# EAGLE design vivepos-v1-1 (EAGLE 6.4)
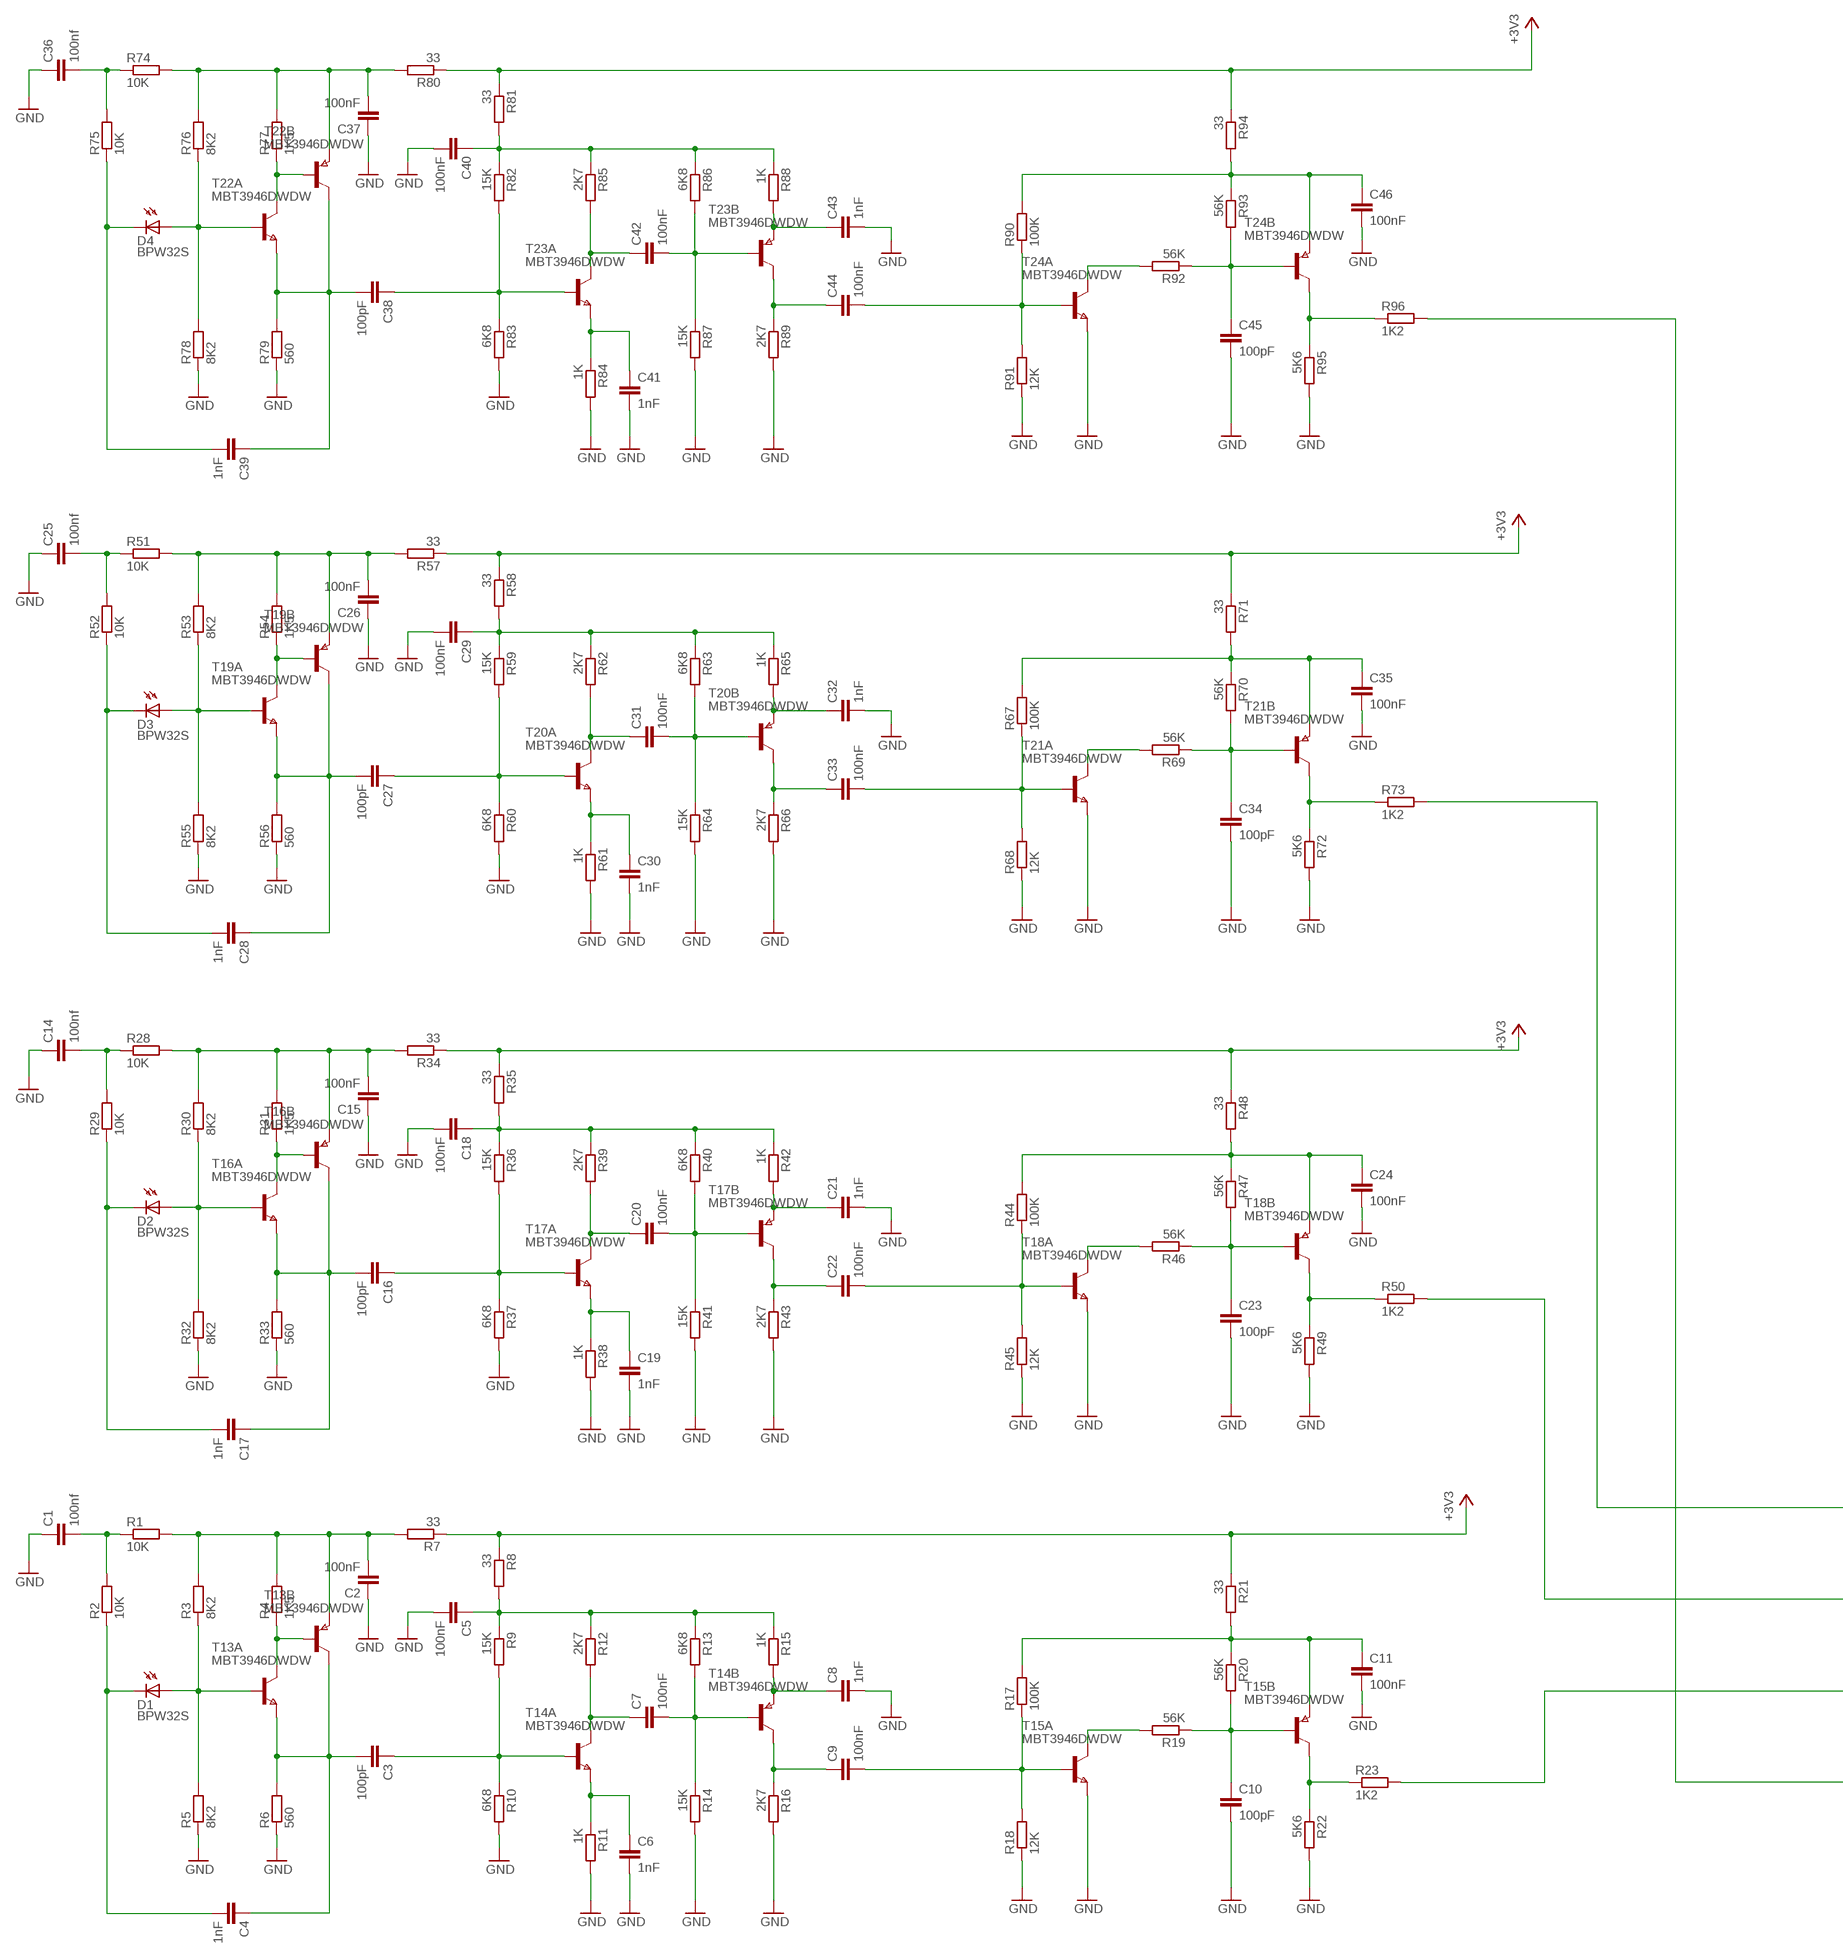
[diagram p0: schematic, sheet 1, part 1 of 2]
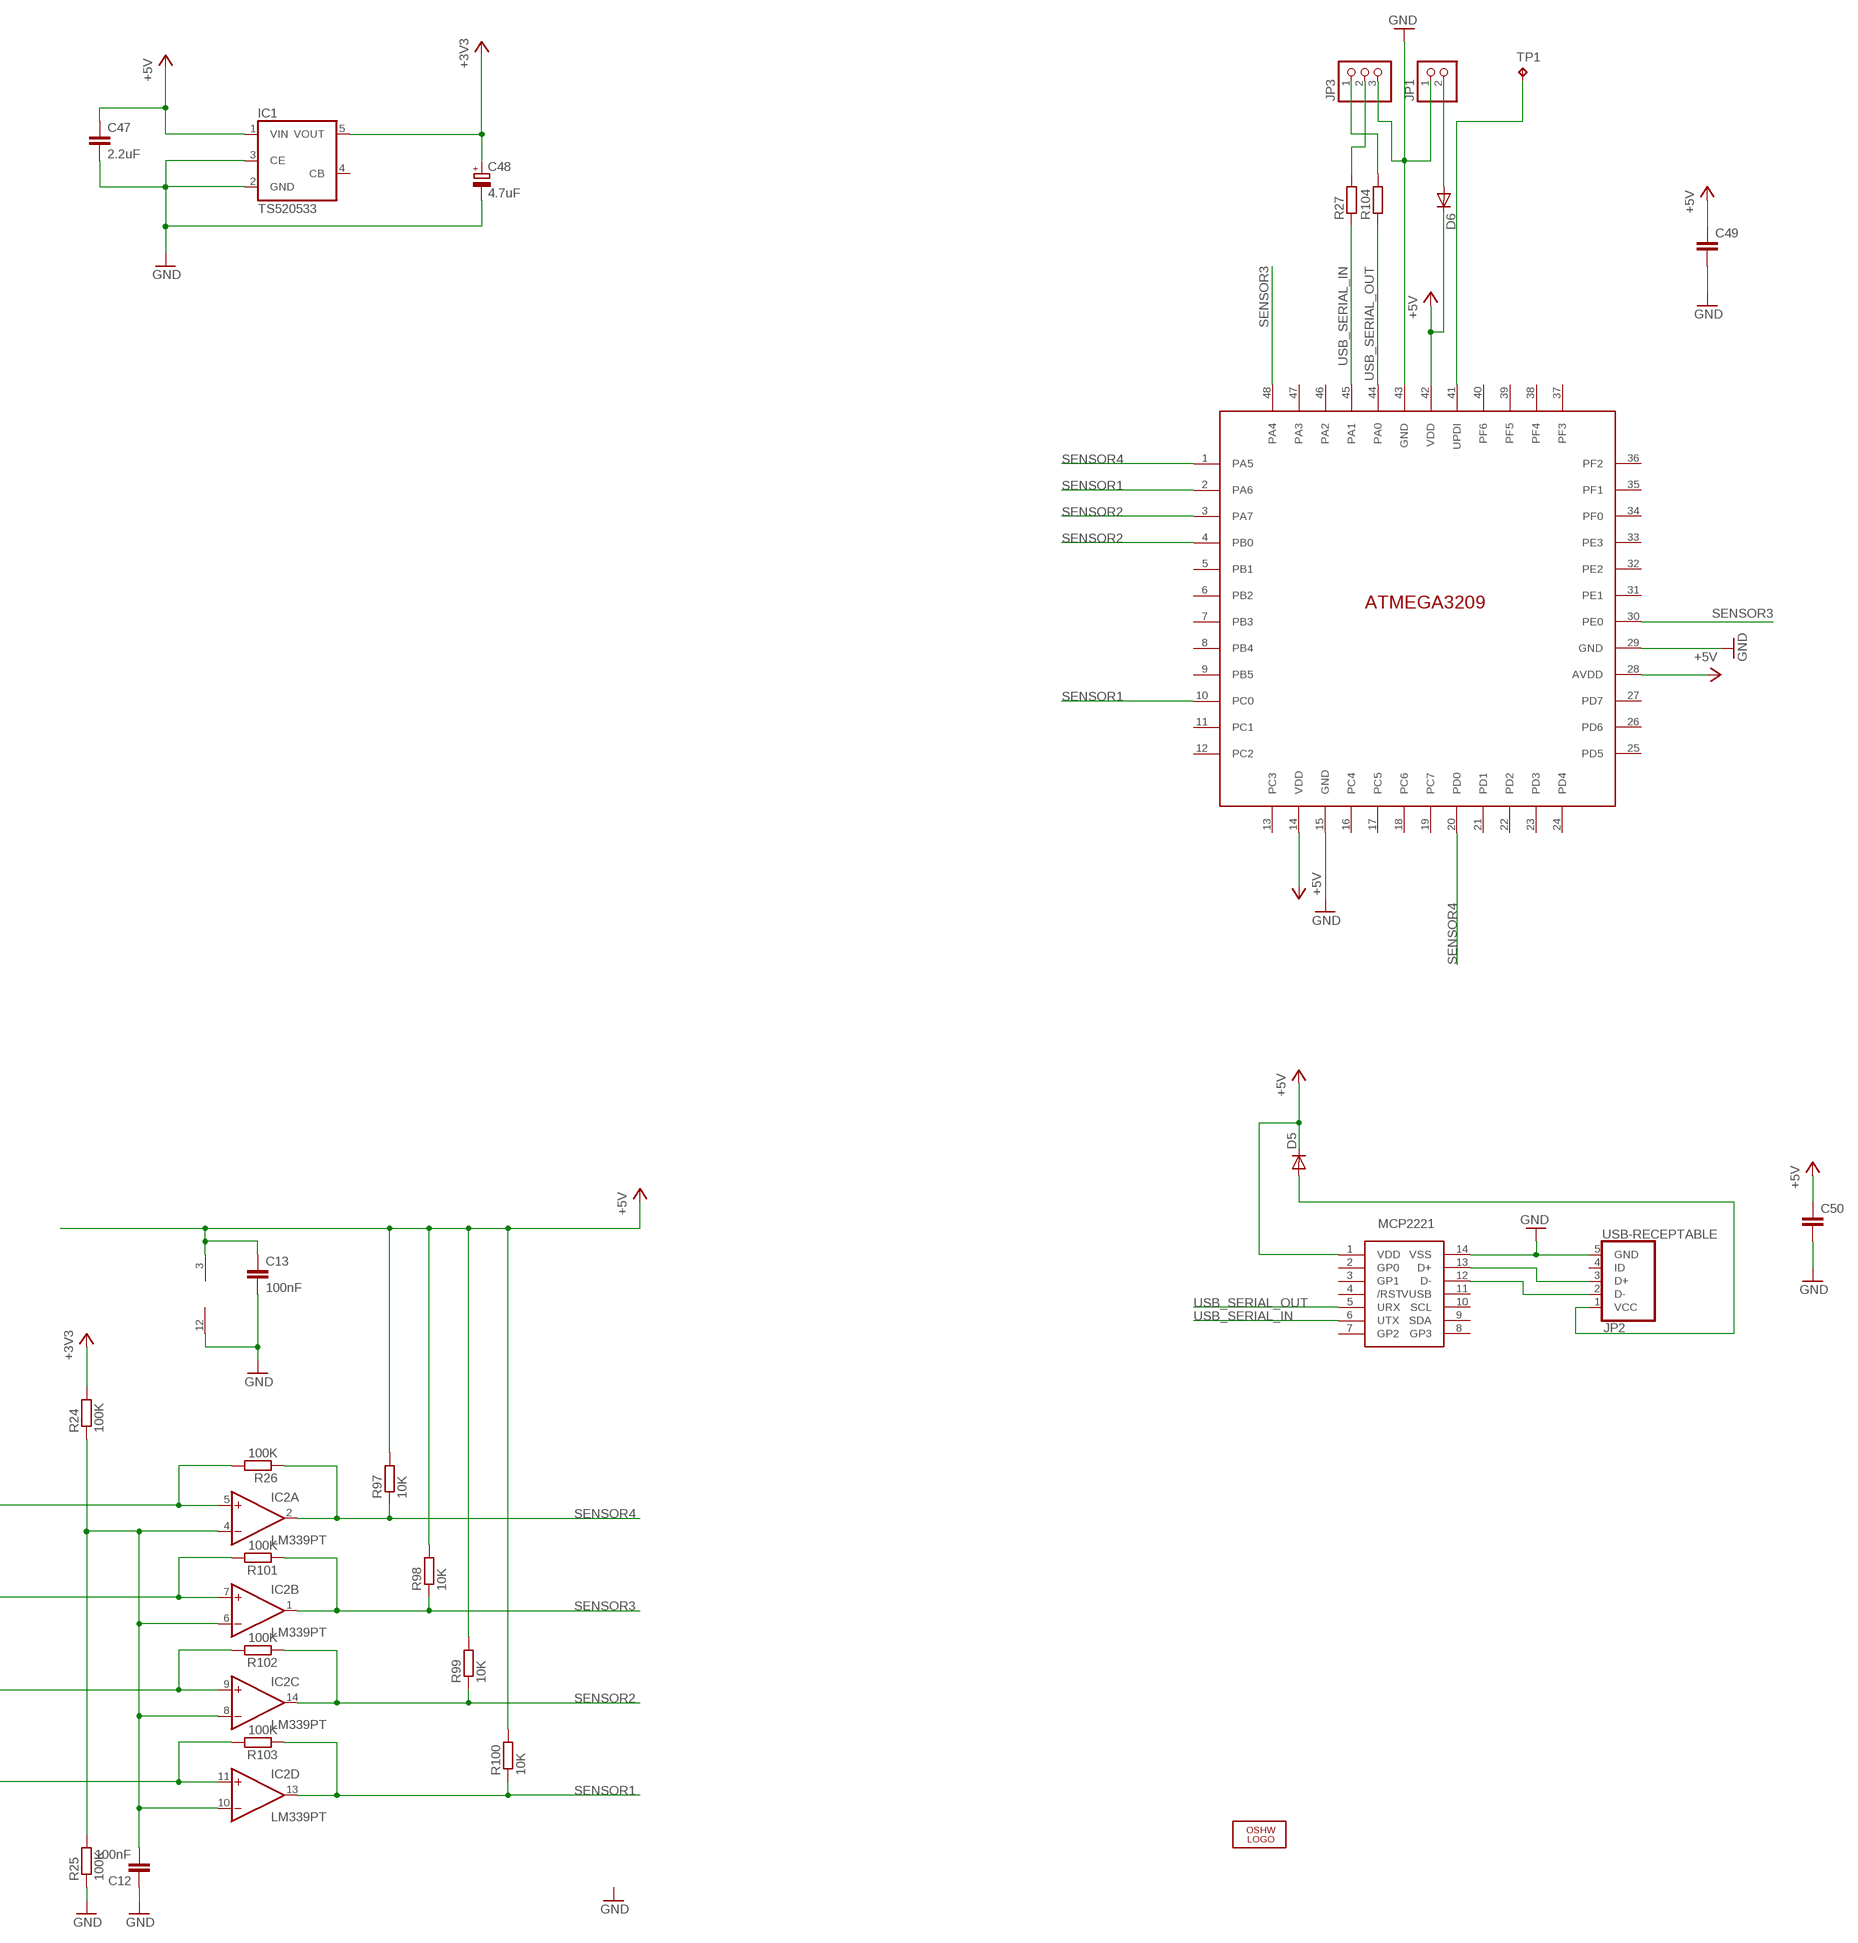
[diagram p1: schematic, sheet 1, part 2 of 2]

## Parts
C1  100nf  C-EUC0402  [C0402]
C2  100nF  C-EUC0402  [C0402]
C3  100pF  C-EUC0402  [C0402]
C4  1nF  C-EUC0402  [C0402]
C5  100nF  C-EUC0402  [C0402]
C6  1nF  C-EUC0402  [C0402]
C7  100nF  C-EUC0402  [C0402]
C8  1nF  C-EUC0402  [C0402]
C9  100nF  C-EUC0402  [C0402]
C10  100pF  C-EUC0402  [C0402]
C11  100nF  C-EUC0402  [C0402]
C12  100nF  C-EUC0402  [C0402]
C13  100nF  C-EUC0402  [C0402]
C14  100nf  C-EUC0402  [C0402]
C15  100nF  C-EUC0402  [C0402]
C16  100pF  C-EUC0402  [C0402]
C17  1nF  C-EUC0402  [C0402]
C18  100nF  C-EUC0402  [C0402]
C19  1nF  C-EUC0402  [C0402]
C20  100nF  C-EUC0402  [C0402]
C21  1nF  C-EUC0402  [C0402]
C22  100nF  C-EUC0402  [C0402]
C23  100pF  C-EUC0402  [C0402]
C24  100nF  C-EUC0402  [C0402]
C25  100nf  C-EUC0402  [C0402]
C26  100nF  C-EUC0402  [C0402]
C27  100pF  C-EUC0402  [C0402]
C28  1nF  C-EUC0402  [C0402]
C29  100nF  C-EUC0402  [C0402]
C30  1nF  C-EUC0402  [C0402]
C31  100nF  C-EUC0402  [C0402]
C32  1nF  C-EUC0402  [C0402]
C33  100nF  C-EUC0402  [C0402]
C34  100pF  C-EUC0402  [C0402]
C35  100nF  C-EUC0402  [C0402]
C36  100nf  C-EUC0402  [C0402]
C37  100nF  C-EUC0402  [C0402]
C38  100pF  C-EUC0402  [C0402]
C39  1nF  C-EUC0402  [C0402]
C40  100nF  C-EUC0402  [C0402]
C41  1nF  C-EUC0402  [C0402]
C42  100nF  C-EUC0402  [C0402]
C43  1nF  C-EUC0402  [C0402]
C44  100nF  C-EUC0402  [C0402]
C45  100pF  C-EUC0402  [C0402]
C46  100nF  C-EUC0402  [C0402]
C47  2.2uF  C-EUC0805  [C0805]
C48  4.7uF  CPOL-EUB/3528-21R  [B/3528-21R]
C49  C-EUC0402  [C0402]
C50  C-EUC0603  [C0603]
D1  BPW32S  [BPW34S]
D2  BPW32S  [BPW34S]
D3  BPW32S  [BPW34S]
D4  BPW32S  [BPW34S]
D5  DIODE-SOD323-W  [SOD323-W]
D6  DIODE-SOD323-W  [SOD323-W]
IC1  TS520533  [SOT25]
IC2  LM339PT  [TSSOP14]
JP1  PINHD-1X2  [1X02]
JP2  USB-RECEPTABLE  [FCI-10103594-0001LF]
JP3  PINHD-1X3  [1X03]
LOGO1  OSHW_LOGO_FILLX0200-NT  [OSHW_FILLX200_NOTEXT]
R1  10K  R-EU_R0402  [R0402]
R2  10K  R-EU_R0402  [R0402]
R3  8K2  R-EU_R0402  [R0402]
R4  1K5  R-EU_R0402  [R0402]
R5  8K2  R-EU_R0402  [R0402]
R6  560  R-EU_R0402  [R0402]
R7  33  R-EU_R0402  [R0402]
R8  33  R-EU_R0402  [R0402]
R9  15K  R-EU_R0402  [R0402]
R10  6K8  R-EU_R0402  [R0402]
R11  1K  R-EU_R0402  [R0402]
R12  2K7  R-EU_R0402  [R0402]
R13  6K8  R-EU_R0402  [R0402]
R14  15K  R-EU_R0402  [R0402]
R15  1K  R-EU_R0402  [R0402]
R16  2K7  R-EU_R0402  [R0402]
R17  100K  R-EU_R0402  [R0402]
R18  12K  R-EU_R0402  [R0402]
R19  56K  R-EU_R0402  [R0402]
R20  56K  R-EU_R0402  [R0402]
R21  33  R-EU_R0402  [R0402]
R22  5K6  R-EU_R0402  [R0402]
R23  1K2  R-EU_R0402  [R0402]
R24  100K  R-EU_R0402  [R0402]
R25  100K  R-EU_R0402  [R0402]
R26  100K  R-EU_R0402  [R0402]
R27  R-EU_R0402  [R0402]
R28  10K  R-EU_R0402  [R0402]
R29  10K  R-EU_R0402  [R0402]
R30  8K2  R-EU_R0402  [R0402]
R31  1K5  R-EU_R0402  [R0402]
R32  8K2  R-EU_R0402  [R0402]
R33  560  R-EU_R0402  [R0402]
R34  33  R-EU_R0402  [R0402]
R35  33  R-EU_R0402  [R0402]
R36  15K  R-EU_R0402  [R0402]
R37  6K8  R-EU_R0402  [R0402]
R38  1K  R-EU_R0402  [R0402]
R39  2K7  R-EU_R0402  [R0402]
R40  6K8  R-EU_R0402  [R0402]
R41  15K  R-EU_R0402  [R0402]
R42  1K  R-EU_R0402  [R0402]
R43  2K7  R-EU_R0402  [R0402]
R44  100K  R-EU_R0402  [R0402]
R45  12K  R-EU_R0402  [R0402]
R46  56K  R-EU_R0402  [R0402]
R47  56K  R-EU_R0402  [R0402]
R48  33  R-EU_R0402  [R0402]
R49  5K6  R-EU_R0402  [R0402]
R50  1K2  R-EU_R0402  [R0402]
R51  10K  R-EU_R0402  [R0402]
R52  10K  R-EU_R0402  [R0402]
R53  8K2  R-EU_R0402  [R0402]
R54  1K5  R-EU_R0402  [R0402]
R55  8K2  R-EU_R0402  [R0402]
R56  560  R-EU_R0402  [R0402]
R57  33  R-EU_R0402  [R0402]
R58  33  R-EU_R0402  [R0402]
R59  15K  R-EU_R0402  [R0402]
R60  6K8  R-EU_R0402  [R0402]
R61  1K  R-EU_R0402  [R0402]
R62  2K7  R-EU_R0402  [R0402]
R63  6K8  R-EU_R0402  [R0402]
R64  15K  R-EU_R0402  [R0402]
R65  1K  R-EU_R0402  [R0402]
R66  2K7  R-EU_R0402  [R0402]
R67  100K  R-EU_R0402  [R0402]
R68  12K  R-EU_R0402  [R0402]
R69  56K  R-EU_R0402  [R0402]
R70  56K  R-EU_R0402  [R0402]
R71  33  R-EU_R0402  [R0402]
R72  5K6  R-EU_R0402  [R0402]
R73  1K2  R-EU_R0402  [R0402]
R74  10K  R-EU_R0402  [R0402]
R75  10K  R-EU_R0402  [R0402]
R76  8K2  R-EU_R0402  [R0402]
R77  1K5  R-EU_R0402  [R0402]
R78  8K2  R-EU_R0402  [R0402]
R79  560  R-EU_R0402  [R0402]
R80  33  R-EU_R0402  [R0402]
R81  33  R-EU_R0402  [R0402]
R82  15K  R-EU_R0402  [R0402]
R83  6K8  R-EU_R0402  [R0402]
R84  1K  R-EU_R0402  [R0402]
R85  2K7  R-EU_R0402  [R0402]
R86  6K8  R-EU_R0402  [R0402]
R87  15K  R-EU_R0402  [R0402]
R88  1K  R-EU_R0402  [R0402]
R89  2K7  R-EU_R0402  [R0402]
R90  100K  R-EU_R0402  [R0402]
R91  12K  R-EU_R0402  [R0402]
R92  56K  R-EU_R0402  [R0402]
R93  56K  R-EU_R0402  [R0402]
R94  33  R-EU_R0402  [R0402]
R95  5K6  R-EU_R0402  [R0402]
R96  1K2  R-EU_R0402  [R0402]
R97  10K  R-EU_R0402  [R0402]
R98  10K  R-EU_R0402  [R0402]
R99  10K  R-EU_R0402  [R0402]
R100  10K  R-EU_R0402  [R0402]
R101  100K  R-EU_R0402  [R0402]
R102  100K  R-EU_R0402  [R0402]
R103  100K  R-EU_R0402  [R0402]
R104  R-EU_R0402  [R0402]
T13  MBT3946DWDW  [SOT363_PHILIPS]
T14  MBT3946DWDW  [SOT363_PHILIPS]
T15  MBT3946DWDW  [SOT363_PHILIPS]
T16  MBT3946DWDW  [SOT363_PHILIPS]
T17  MBT3946DWDW  [SOT363_PHILIPS]
T18  MBT3946DWDW  [SOT363_PHILIPS]
T19  MBT3946DWDW  [SOT363_PHILIPS]
T20  MBT3946DWDW  [SOT363_PHILIPS]
T21  MBT3946DWDW  [SOT363_PHILIPS]
T22  MBT3946DWDW  [SOT363_PHILIPS]
T23  MBT3946DWDW  [SOT363_PHILIPS]
T24  MBT3946DWDW  [SOT363_PHILIPS]
TP1  TPTP15R  [TP15R]
U$1  MCP2221  [SOIC14]
U$2  ATMEGA3209  [TQFP48]

## Nets
+3V3: C48.+ IC1.5(VOUT) R7.1 R8.1 R21.1 R24.2 R34.1 R35.1 R48.1 R57.1 R58.1 R71.1 R80.1 R81.1 R94.1
+5V: C13.1 C47.1 C49.1 C50.1 D5.C D6.C IC1.1(VIN) IC2.3(P:V+) R97.2 R98.2 R99.2 R100.2 U$1.1(VDD) U$2.14(VDD) U$2.28(AVDD) U$2.42(VDD)
GND: C1.1 C2.1 C5.2 C6.2 C8.2 C10.2 C11.2 C12.1 C13.2 C14.1 C15.1 C18.2 C19.2 C21.2 C23.2 C24.2 C25.1 C26.1 C29.2 C30.2 C32.2 C34.2 C35.2 C36.1 C37.1 C40.2 C41.2 C43.2 C45.2 C46.2 C47.2 C48.- C49.2 C50.2 IC1.2(GND) IC1.3(CE) IC2.12(P:GND) JP1.1 JP2.5(GND) JP3.3 R5.1 R6.1 R10.2 R11.2 R14.2 R16.2 R18.1 R22.2 R25.1 R32.1 R33.1 R37.2 R38.2 R41.2 R43.2 R45.1 R49.2 R55.1 R56.1 R60.2 R61.2 R64.2 R66.2 R68.1 R72.2 R78.1 R79.1 R83.2 R84.2 R87.2 R89.2 R91.1 R95.2 T15.1(A:E) T18.1(A:E) T21.1(A:E) T24.1(A:E) U$1.14(VSS) U$2.15(GND) U$2.29(GND) U$2.43(GND)
N$1: C1.2 R1.1 R2.2
N$2: C2.2 R1.2 R3.2 R4.2 R7.2 T13.4(B:E)
N$3: R4.1 T13.5(B:B) T13.6(A:C)
N$4: D1.A R3.1 R5.2 T13.2(A:B)
N$5: C3.2 C4.1 R6.2 T13.1(A:E) T13.3(B:C)
N$7: C5.1 R8.2 R9.1 R12.1 R13.1 R15.1
N$8: C3.1 R9.2 R10.1 T14.2(A:B)
N$9: C7.1 R12.2 T14.6(A:C)
N$10: C6.1 R11.1 T14.1(A:E)
N$11: C8.1 R15.2 T14.4(B:E)
N$12: C7.2 R13.2 R14.1 T14.5(B:B)
N$13: C9.1 R16.1 T14.3(B:C)
N$14: C4.2 D1.K(C) R2.1
N$15: C9.2 R17.1 R18.2 T15.2(A:B)
N$16: C11.1 R17.2 R20.1 R21.2 T15.4(B:E)
N$17: C10.1 R19.1 R20.2 T15.5(B:B)
N$18: R19.2 T15.6(A:C)
N$19: R22.1 R23.1 T15.3(B:C)
N$20: IC2.9(C:+IN) R23.2 R102.2
N$21: C12.2 IC2.4(A:-IN) IC2.6(B:-IN) IC2.8(C:-IN) IC2.10(D:-IN) R24.1 R25.2
N$22: C14.2 R28.1 R29.2
N$23: D6.A JP1.2
N$24: C15.2 R28.2 R30.2 R31.2 R34.2 T16.4(B:E)
N$25: R31.1 T16.5(B:B) T16.6(A:C)
N$26: D2.A R30.1 R32.2 T16.2(A:B)
N$27: C16.2 C17.1 R33.2 T16.1(A:E) T16.3(B:C)
N$28: D5.A JP2.1(VCC)
N$29: C18.1 R35.2 R36.1 R39.1 R40.1 R42.1
N$30: C16.1 R36.2 R37.1 T17.2(A:B)
N$31: C20.1 R39.2 T17.6(A:C)
N$32: C19.1 R38.1 T17.1(A:E)
N$33: C20.2 R40.2 R41.1 T17.5(B:B)
N$34: C21.1 R42.2 T17.4(B:E)
N$35: C22.1 R43.1 T17.3(B:C)
N$36: C17.2 D2.K(C) R29.1
N$37: C22.2 R44.1 R45.2 T18.2(A:B)
N$38: C24.1 R44.2 R47.1 R48.2 T18.4(B:E)
N$39: C23.1 R46.1 R47.2 T18.5(B:B)
N$40: R46.2 T18.6(A:C)
N$41: R49.1 R50.1 T18.3(B:C)
N$43: C25.2 R51.1 R52.2
N$44: C26.2 R51.2 R53.2 R54.2 R57.2 T19.4(B:E)
N$45: R54.1 T19.5(B:B) T19.6(A:C)
N$46: D3.A R53.1 R55.2 T19.2(A:B)
N$47: C27.2 C28.1 R56.2 T19.1(A:E) T19.3(B:C)
N$48: TP1.TP U$2.41(UPDI)
N$49: C29.1 R58.2 R59.1 R62.1 R63.1 R65.1
N$50: C27.1 R59.2 R60.1 T20.2(A:B)
N$51: C31.1 R62.2 T20.6(A:C)
N$52: C30.1 R61.1 T20.1(A:E)
N$53: C31.2 R63.2 R64.1 T20.5(B:B)
N$54: C32.1 R65.2 T20.4(B:E)
N$55: C33.1 R66.1 T20.3(B:C)
N$56: C28.2 D3.K(C) R52.1
N$57: C33.2 R67.1 R68.2 T21.2(A:B)
N$58: C35.1 R67.2 R70.1 R71.2 T21.4(B:E)
N$59: C34.1 R69.1 R70.2 T21.5(B:B)
N$60: R69.2 T21.6(A:C)
N$61: R72.1 R73.1 T21.3(B:C)
N$62: JP3.2 R27.2
N$63: C36.2 R74.1 R75.2
N$64: C37.2 R74.2 R76.2 R77.2 R80.2 T22.4(B:E)
N$65: R77.1 T22.5(B:B) T22.6(A:C)
N$66: D4.A R76.1 R78.2 T22.2(A:B)
N$67: C38.2 C39.1 R79.2 T22.1(A:E) T22.3(B:C)
N$68: JP3.1 R104.2
N$69: C40.1 R81.2 R82.1 R85.1 R86.1 R88.1
N$70: C38.1 R82.2 R83.1 T23.2(A:B)
N$71: C42.1 R85.2 T23.6(A:C)
N$72: C41.1 R84.1 T23.1(A:E)
N$73: C42.2 R86.2 R87.1 T23.5(B:B)
N$74: C43.1 R88.2 T23.4(B:E)
N$75: C44.1 R89.1 T23.3(B:C)
N$76: C39.2 D4.K(C) R75.1
N$77: C44.2 R90.1 R91.2 T24.2(A:B)
N$78: C46.1 R90.2 R93.1 R94.2 T24.4(B:E)
N$79: C45.1 R92.1 R93.2 T24.5(B:B)
N$80: R92.2 T24.6(A:C)
N$81: R95.1 R96.1 T24.3(B:C)
N$82: JP2.3(D+) U$1.13(D+)
N$83: JP2.2(D-) U$1.12(D-)
N$84: IC2.7(B:+IN) R50.2 R101.2
N$85: IC2.11(D:+IN) R96.2 R103.2
N$87: IC2.5(A:+IN) R26.2 R73.2
SENSOR1: IC2.13(D:OUT) R100.1 R103.1 U$2.2(PA6) U$2.10(PC0)
SENSOR2: IC2.14(C:OUT) R99.1 R102.1 U$2.3(PA7) U$2.4(PB0)
SENSOR3: IC2.1(B:OUT) R98.1 R101.1 U$2.30(PE0) U$2.48(PA4)
SENSOR4: IC2.2(A:OUT) R26.1 R97.1 U$2.1(PA5) U$2.20(PD0)
USB_SERIAL_IN: R27.1 U$1.6(UTX) U$2.45(PA1)
USB_SERIAL_OUT: R104.1 U$1.5(URX) U$2.44(PA0)
Unconnected: IC1.4(CB) JP2.4(ID) U$1.2(GP0) U$1.3(GP1) U$1.4(/RST) U$1.7(GP2) U$1.8(GP3) U$1.9(SDA) U$1.10(SCL) U$1.11(VUSB) U$2.5(PB1) U$2.6(PB2) U$2.7(PB3) U$2.8(PB4) U$2.9(PB5) U$2.11(PC1) U$2.12(PC2) U$2.13(PC3) U$2.16(PC4) U$2.17(PC5) U$2.18(PC6) U$2.19(PC7) U$2.21(PD1) U$2.22(PD2) U$2.23(PD3) U$2.24(PD4) U$2.25(PD5) U$2.26(PD6) U$2.27(PD7) U$2.31(PE1) U$2.32(PE2) U$2.33(PE3) U$2.34(PF0) U$2.35(PF1) U$2.36(PF2) U$2.37(PF3) U$2.38(PF4) U$2.39(PF5) U$2.40(PF6) U$2.46(PA2) U$2.47(PA3)

## Library data of the parts
C1-C47 C49 C50 = resistor:C-EU: CAPACITOR, European symbol
C48 = resistor:CPOL-EU: POLARIZED CAPACITOR, European symbol
D1-D4 = __SR:BPW32: PHOTO DIODE
D5 D6 = diode:DIODE-: DIODE
IC1 = v-reg:TS5205: 150mA Low Noise LDO Voltage Regulator with Enable TSC [Taiwan Semiconductor Company, Ltd] Source: http://www.taiwansemi.com .. 5205_0409c.pdf
IC2 = __SR:LM339: Low Power Low Offset Voltage Quad Comparators with open collector; LM139/LM239/LM339/LM2901/LM3302
JP1 = pinhead:PINHD-1X2: PIN HEADER
JP2 = daspilker:USB-RECEPTABLE: USB Receptable
JP3 = pinhead:PINHD-1X3: PIN HEADER
LOGO1 = ohw-logo:OSHW_LOGO_FILL
R1-R104 = resistor:R-EU_: RESISTOR, European symbol
T13-T24 = __SR:MBT3946DW: Dual NPN PNP TRANSISTOR
TP1 = testpad:TP: Test pad
U$1 = __SR:MCP2221
U$2 = __SR:ATMEGA3209

## Board
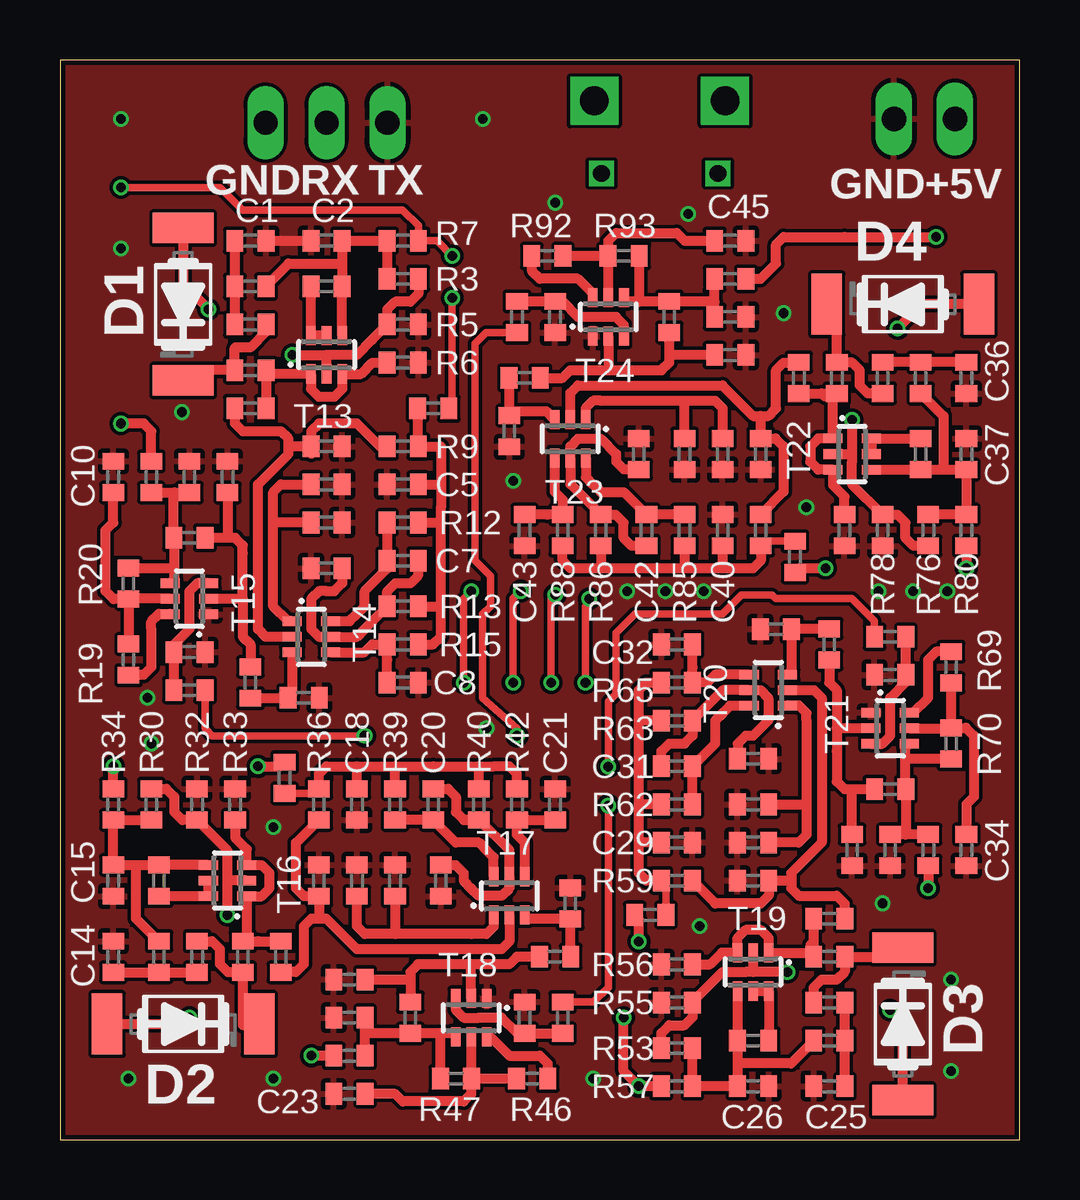
[diagram p2: board, top side]
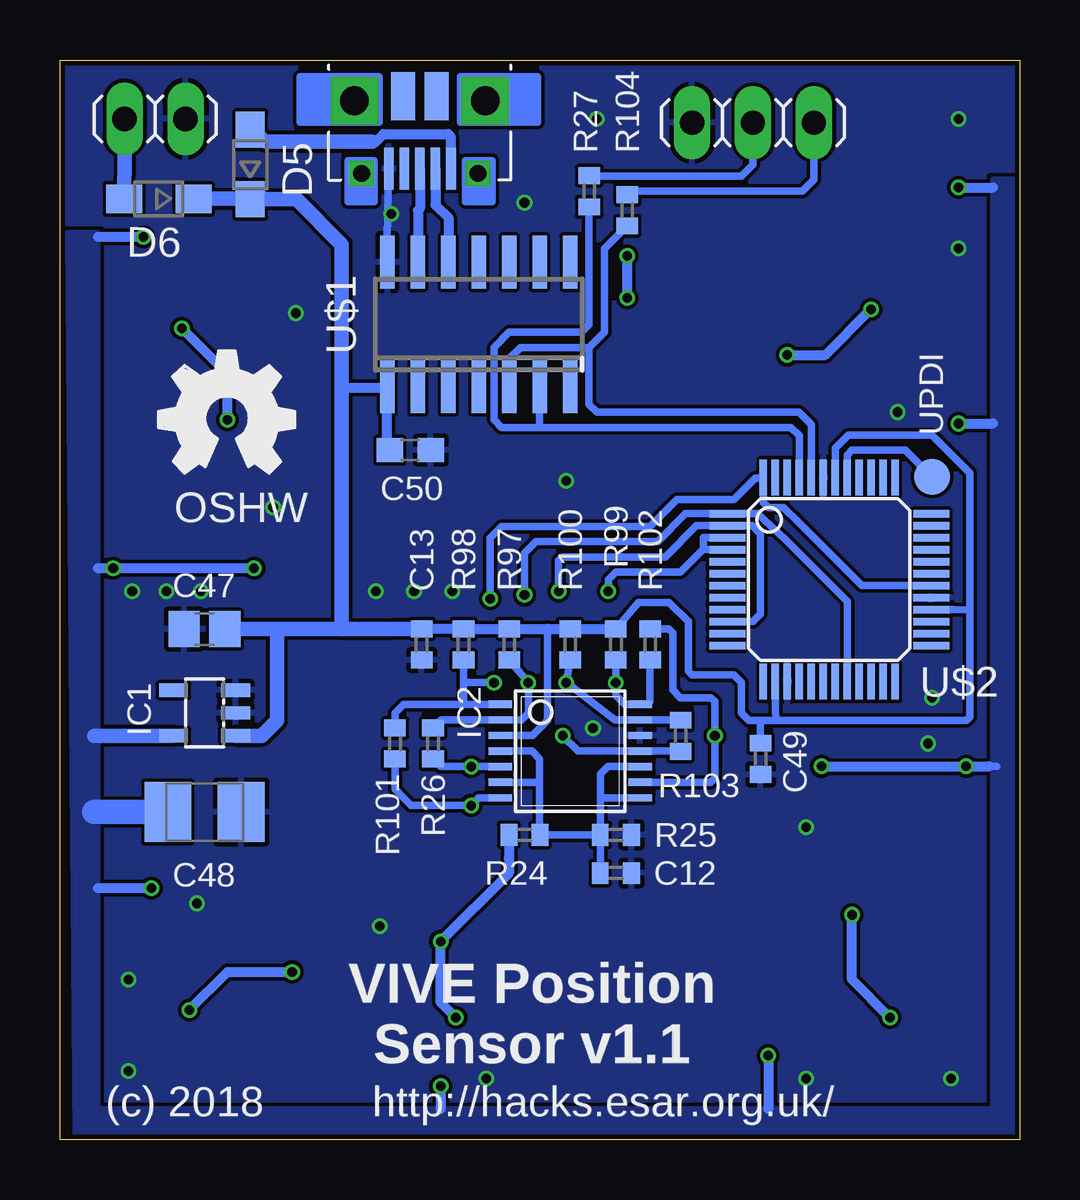
[diagram p3: board, bottom side, seen from below]

Size 40 x 45 mm. Coordinates in mm from the lower left corner, seen from the top.
Outline: 0,0 40,0 40,45 0,45 0,0
Copper layers (1*16): Top 0.018mm / dielectric 1.55mm / Bottom 0.018mm
Design rules "Multi-CB_2L_100цm-Tracks_OL35цm *": minimum track width 0.1mm, minimum drill 0.2mm, track to track 0.15mm, track to pad 0.15mm, pad to pad 0.15mm, via to via 0.15mm, smd to smd 0.15mm, copper to edge 0.2mm, drill to drill 0.2mm, minimum pad ring 0.125mm, minimum via ring 0.125mm, stop-mask expansion 2mil, vias tented up to drill 0.5mm, thermal gap 0.2mm

### Footprints (pad centres in the part's own frame; a part is rotated, then mirrored left to right if it is on the bottom)
C0402 = smd 0.7 x 0.9: 1 -0.65,0; 2 0.65,0
C0805 = smd 1.3 x 1.5: 1 -0.85,0; 2 0.85,0
B/3528-21R = smd 1.95 x 2.5: + 1.525,0; - -1.525,0
C0603 = smd 1.1 x 1: 1 -0.85,0; 2 0.85,0
BPW34S = smd 2.54 x 1.27: A 0,3.175; K 0,-3.175
SOD323-W = smd 1.5 x 1.2: A 1.45,0; C -1.45,0
SOT25 = smd 0.55 x 1.2: 1 -0.95,-1.3; 2 0,-1.3; 3 0.95,-1.3; 4 0.95,1.3; 5 -0.95,1.3
TSSOP14 = smd 0.305 x 0.991: 1 -1.95,-2.918; 2 -1.3,-2.918; 3 -0.65,-2.918; 4 0,-2.918; 5 0.65,-2.918; 6 1.3,-2.918; 7 1.95,-2.918; 8 1.95,2.918; 9 1.3,2.918; 10 0.65,2.918; 11 0,2.918; 12 -0.65,2.918; 13 -1.3,2.918; 14 -1.95,2.918
1X02 = drill 1.016 long: 1 -1.27,0; 2 1.27,0
FCI-10103594-0001LF = smd 0.4 x 1.75: 1 -1.3,4.525; 2 -0.65,4.525; 3 0,4.525; 4 0.65,4.525; 5 1.3,4.525 | drill 0.7 square: CASE@1 -2.425,4.725; CASE@3 2.425,4.725 | drill 1.2 pad 2 square: CASE@5 -2.725,1.7; CASE@6 2.725,1.7 | smd 1 x 2: P$7 -0.7,1.5; P$8 0.7,1.5
1X03 = drill 1.016 long: 1 -2.54,0; 2 0,0; 3 2.54,0
R0402 = smd 0.7 x 0.9: 1 -0.65,0; 2 0.65,0
SOT363_PHILIPS = smd 0.4 x 0.8: 1 -0.65,-0.8; 2 0,-0.8; 3 0.65,-0.8; 4 0.65,0.8; 5 0,0.8; 6 -0.65,0.8
TP15R = smd 1.5 x 1.5: TP 0,0
SOIC14 = smd 0.6 x 2.2: 1 -3.81,-2.6; 2 -2.54,-2.6; 3 -1.27,-2.6; 4 0,-2.6; 5 1.27,-2.6; 6 2.54,-2.6; 7 3.81,-2.6; 8 3.81,2.6; 9 2.54,2.6; 10 1.27,2.6; 11 0,2.6; 12 -1.27,2.6; 13 -2.54,2.6; 14 -3.81,2.6
TQFP48 = smd 0.3 x 1.5: 1 -2.75,-4.25; 2 -2.25,-4.25; 3 -1.75,-4.25; 4 -1.25,-4.25; 5 -0.75,-4.25; 6 -0.25,-4.25; 7 0.25,-4.25; 8 0.75,-4.25; 9 1.25,-4.25; 10 1.75,-4.25; 11 2.25,-4.25; 12 2.75,-4.25; 25 2.75,4.25; 26 2.25,4.25; 27 1.75,4.25; 28 1.25,4.25; 29 0.75,4.25; 30 0.25,4.25; 31 -0.25,4.25; 32 -0.75,4.25; 33 -1.25,4.25; 34 -1.75,4.25; 35 -2.25,4.25; 36 -2.75,4.25 | smd 1.5 x 0.3: 13 4.25,-2.75; 14 4.25,-2.25; 15 4.25,-1.75; 16 4.25,-1.25; 17 4.25,-0.75; 18 4.25,-0.25; 19 4.25,0.25; 20 4.25,0.75; 21 4.25,1.25; 22 4.25,1.75; 23 4.25,2.25; 24 4.25,2.75; 37 -4.25,2.75; 38 -4.25,2.25; 39 -4.25,1.75; 40 -4.25,1.25; 41 -4.25,0.75; 42 -4.25,0.25; 43 -4.25,-0.25; 44 -4.25,-0.75; 45 -4.25,-1.25; 46 -4.25,-1.75; 47 -4.25,-2.25; 48 -4.25,-2.75

### Placement (x,y rotation side)
C1  7.94,37.47 180 top
C2  11.11,37.47 0 top
C3  7.94,30.48 0 top
C4  7.94,32.07 180 top
C5  14.29,27.3 180 top
C6  11.11,27.3 0 top
C7  14.29,24.13 0 top
C8  14.29,19.05 0 top
C9  7.94,19.05 90 top
C10  2.22,27.62 90 top
C11  5.4,27.62 90 top
C12  16.83,11.11 180 bottom
C13  24.92,20.64 270 bottom
C14  2.22,7.62 270 top
C15  2.22,10.79 90 top
C16  9.21,7.62 90 top
C17  7.62,7.62 270 top
C18  12.38,13.97 270 top
C19  12.38,10.79 90 top
C20  15.56,13.97 90 top
C21  20.64,13.97 90 top
C22  20.64,7.62 180 top
C23  12.06,1.91 180 top
C24  12.06,5.08 180 top
C25  32.07,2.22 0 top
C26  28.89,2.22 180 top
C27  32.07,9.21 180 top
C28  32.07,7.62 0 top
C29  25.72,12.38 0 top
C30  28.89,12.38 180 top
C31  25.72,15.56 180 top
C32  25.72,20.64 180 top
C33  32.07,20.64 270 top
C34  37.78,12.06 270 top
C35  34.61,12.06 270 top
C36  37.78,31.75 90 top
C37  37.78,28.57 270 top
C38  30.8,31.75 270 top
C39  32.38,31.75 90 top
C40  27.62,25.4 90 top
C41  27.62,28.57 270 top
C42  24.45,25.4 270 top
C43  19.37,25.4 270 top
C44  19.37,31.75 0 top
C45  27.94,37.47 0 top
C46  27.94,34.29 0 top
C47  33.97,21.27 180 bottom
C48  33.97,13.65 180 bottom
C49  10.79,15.88 270 bottom
C50  25.4,28.73 0 bottom
D1  5.13,34.82 0 top
D2  5.13,4.82 90 top
D3  35.13,4.82 180 top
D4  35.13,34.82 270 top
D5  32.07,40.64 90 bottom
D6  35.88,39.21 180 bottom
IC1  33.97,17.78 90 bottom
IC2  18.73,16.19 270 bottom
JP1  36.04,42.55 180 bottom
JP2  25,45 180 bottom
JP3  11.11,42.39 180 bottom
LOGO1  35.88,27.78 0 bottom
R1  7.94,35.56 0 top
R2  7.94,33.97 180 top
R3  14.29,35.88 180 top
R4  11.11,35.56 0 top
R5  14.29,33.97 180 top
R6  14.29,32.38 180 top
R7  14.29,37.47 180 top
R8  15.56,30.48 180 top
R9  14.29,28.89 180 top
R10  11.11,28.89 0 top
R11  11.11,25.72 0 top
R12  14.29,25.72 180 top
R13  14.29,22.23 180 top
R14  11.11,23.81 180 top
R15  14.29,20.64 180 top
R16  10.16,18.41 0 top
R17  5.4,25.08 180 top
R18  6.99,27.62 270 top
R19  2.86,20 270 top
R20  2.86,23.18 270 top
R21  3.81,27.62 270 top
R22  5.4,20.32 0 top
R23  5.4,18.73 0 top
R24  20.64,12.7 180 bottom
R25  16.83,12.7 180 bottom
R26  24.45,16.51 270 bottom
R27  17.94,39.53 90 bottom
R28  4.13,7.62 90 top
R29  5.71,7.62 270 top
R30  3.81,13.97 270 top
R31  4.13,10.79 90 top
R32  5.71,13.97 270 top
R33  7.3,13.97 270 top
R34  2.22,13.97 270 top
R35  9.37,15.08 270 top
R36  10.79,13.97 270 top
R37  10.79,10.79 90 top
R38  13.97,10.79 90 top
R39  13.97,13.97 270 top
R40  17.46,13.97 270 top
R41  15.88,10.79 270 top
R42  19.05,13.97 270 top
R43  21.27,9.84 90 top
R44  14.61,5.08 270 top
R45  12.06,6.67 0 top
R46  19.68,2.54 0 top
R47  16.51,2.54 0 top
R48  12.06,3.49 0 top
R49  19.37,5.08 90 top
R50  20.95,5.08 90 top
R51  32.07,4.13 180 top
R52  32.07,5.71 0 top
R53  25.72,3.81 0 top
R54  28.89,4.13 180 top
R55  25.72,5.71 0 top
R56  25.72,7.3 0 top
R57  25.72,2.22 0 top
R58  24.61,9.37 0 top
R59  25.72,10.79 0 top
R60  28.89,10.79 180 top
R61  28.89,13.97 180 top
R62  25.72,13.97 0 top
R63  25.72,17.46 0 top
R64  28.89,15.88 0 top
R65  25.72,19.05 0 top
R66  29.84,21.27 180 top
R67  34.61,14.61 0 top
R68  33.02,12.06 90 top
R69  37.15,19.68 90 top
R70  37.15,16.51 90 top
R71  36.2,12.06 90 top
R72  34.61,19.37 180 top
R73  34.61,20.95 180 top
R74  35.88,31.75 270 top
R75  34.29,31.75 90 top
R76  36.2,25.4 90 top
R77  35.88,28.57 270 top
R78  34.29,25.4 90 top
R79  32.7,25.4 90 top
R80  37.78,25.4 90 top
R81  30.64,24.29 90 top
R82  29.21,25.4 90 top
R83  29.21,28.57 270 top
R84  26.04,28.57 270 top
R85  26.04,25.4 90 top
R86  22.54,25.4 90 top
R87  24.13,28.57 90 top
R88  20.95,25.4 90 top
R89  18.73,29.53 270 top
R90  25.4,34.29 90 top
R91  27.94,32.7 180 top
R92  20.32,36.83 180 top
R93  23.5,36.83 180 top
R94  27.94,35.88 180 top
R95  20.64,34.29 270 top
R96  19.05,34.29 270 top
R97  21.27,20.64 90 bottom
R98  23.18,20.64 90 bottom
R99  16.83,20.64 90 bottom
R100  18.73,20.64 90 bottom
R101  26.04,16.51 270 bottom
R102  15.4,20.64 90 bottom
R103  14.13,16.83 270 bottom
R104  16.35,38.73 90 bottom
T13  11.11,32.72 0 top
T14  10.48,20.95 270 top
T15  5.4,22.54 90 top
T16  6.99,10.79 90 top
T17  18.73,10.16 0 top
T18  17.14,5.08 180 top
T19  28.89,6.99 180 top
T20  29.53,18.73 90 top
T21  34.61,17.14 270 top
T22  33.02,28.57 270 top
T23  21.27,29.21 180 top
T24  22.86,34.29 0 top
TP1  3.65,27.62 0 bottom
U$1  22.54,33.97 0 bottom
U$2  7.94,23.34 270 bottom

### Tracks (layer width: path | path; a pad name or v marks a point on that pad's centre or on a via)
+3V3  (via drill 0.4, 0.4 pad 0.25)
  Top 0.305: v2.54,39.69 5.71,39.69 6.03,39.69 6.67,39.69 7.62,38.73 7.94,38.73 14.29,38.73 14.94,38.09 R7.1 15.72,37.47 v16.35,36.83 | v16.35,35.08 16.35,34.13 16.35,33.5 16.35,31.27 16.35,30.62 R8.1
  Top 0.406: R57.1 v24.13,2.22 23.5,2.86 v23.5,5.08 | R71.1 v36.2,10.48 | R34.1 v2.22,15.56 | R48.1 v10.48,3.49 | R21.1 3.81,29.53 3.49,29.84 v2.54,29.84 | v36.51,37.62 32.7,37.62 30.16,37.62 29.84,37.31 29.84,36.51 29.21,35.88 R94.1 | R80.1 v37.78,23.81 | v8.26,15.56 9.19,15.56 R35.1 | v24.13,8.26 24.13,9.19 R58.1 | v31.91,23.81 30.81,23.81 R81.1
  Bottom 0.305: 1.27,15.56 0.95,15.56
  Bottom 0.406: v24.13,2.22 24.13,1.27 | 1.27,15.56 v2.22,15.56 v8.26,15.56 | v2.54,29.84 1.11,29.84 | v16.35,35.08 16.35,36.51 v16.35,36.83 | R24.2 21.29,11.73 21.29,11.1 v24.13,8.26 24.13,5.71 v23.5,5.08 | v10.48,3.49 10.48,1.27 | v36.2,10.48 38.42,10.48 | v2.54,39.69 1.11,39.69 | v31.91,23.81 v37.78,23.81 38.42,23.81 | v36.51,37.62 38.42,37.62
  Bottom 0.61: IC1.5 38.58,16.83
  Bottom 1.016: C48.+ 38.58,13.65
  pour Bottom: 0,40.01 1.11,40.01 1.11,1.27 38.42,1.27 38.42,37.78 39.69,37.78 39.37,0 0,0
+5V
  Bottom 0.305: 19.68,21.29 19.68,19.05 19.68,18.73 19.68,18.41 19.68,17.46 20.3,16.84 IC2.3 | R99.2 15.89,22.38 14.61,22.38 13.81,21.59 13.81,19.53 13.65,19.37 11.91,19.37 11.59,19.05 11.59,17.78 11.27,17.46 10.79,17.46 | 2.06,22.07 2.06,26.51 2.06,27.78 3.65,29.37 7.14,29.37 7.69,28.82 U$2.42 | 2.06,22.07 2.06,19.68 2.06,17.62 2.22,17.46 10,17.46 10.16,17.46 | U$2.28 2.72,22.09 2.06,22.07 | 10.16,17.46 10.79,17.46 | U$2.14 10.19,17.97 10.16,17.46 | C49.1 10.79,17.46 | 26.39,31.33 U$1.1
  Bottom 0.406: R99.2 R100.2 19.68,21.29 R97.2 R98.2 C13.1 | 28.26,31.27 28.16,31.37 28.12,31.33 26.39,31.33 26.39,28.88 C50.1 26.35,28.84
  Bottom 0.61: 28.26,21.27 28.26,31.27 28.26,33.02 28.26,33.81 28.26,36.51 28.26,37.31 30.14,39.19 D5.C 31.45,39.21 D6.C | 28.26,21.27 26.19,21.27 25.41,21.29 C13.1 | 28.26,21.27 30.96,21.27 | 30.96,21.27 C47.1 | IC1.1 31.59,16.83 30.96,17.46 30.96,21.27
GND  (via drill 0.4)
  Top 0.406: C1.1 C2.1
  Bottom 0.305: JP2.5 26.38,36.6 U$1.14
  other vias: 26.19,38.58 17.78,17.14 3.81,16.51 2.86,2.54 8.89,2.54 22.23,2.54 37.15,2.86 37.15,6.67 34.29,9.84 36.99,22.86 23.65,22.86 5.08,30.32 20.64,39.05 18.89,27.46 31.11,26.35 8.89,13.02 26.67,8.89 3.65,18.41 30.16,34.45 2.54,37.15 25.24,22.86 26.83,22.86 34.13,22.86 35.56,22.86 2.54,42.55 17.62,42.55
  pour Top: 0,0 40,0 40,45 0,45
  pour Bottom (rank 2): 0,45 40,45 40,0 0,0
N$1
  Top 0.406: C1.2 R1.1 R2.2
N$2
  Top 0.406: 11.76,36.51 C2.2 R7.2 R3.2 | 11.76,36.51 R4.2 | R1.2 8.59,35.58 9.53,36.51 11.76,36.51 | 11.75,35.55 R4.2 | T13.4 R4.2
N$3
  Top 0.406: T13.5 T13.6 R4.1 10.48,35.55
N$4  (via drill 0.4 pad 0.25)
  Top 0.406: 11.11,32.7 11.43,32.7 12.38,32.7 13.02,33.34 13.02,33.35 R5.2 13.65,34.27 13.65,34.61 13.97,34.92 14.61,34.92 14.94,35.26 R3.1 | T13.2 11.11,32.7 | v9.68,32.7 11.11,32.7 | D1.A 5.13,35.66 v6.19,34.61
  Bottom 0.406: v9.68,32.7 8.1,32.7 v6.19,34.61
N$5
  Top 0.406: R6.2 13.02,32.38 12.55,31.91 T13.3 11.76,31.29 11.43,30.96 10.79,30.96 | 10.46,31.29 T13.1 8.74,31.91 C4.1 C3.2 | 10.46,31.29 10.79,30.96 | 10.79,30.96 10.46,31.29
N$7
  Top 0.406: 15.88,25.72 15.88,23.18 15.88,22.23 | 15.88,25.72 15.88,26.04 15.88,26.35 15.88,27.3 | R13.1 15.88,22.23 | 15.88,27.3 15.88,28.89 R9.1 | C5.1 15.88,27.3 | R12.1 15.88,25.72 | R15.1 15.56,20.64 15.88,20.95 15.88,22.23 | 14.92,28.91 R9.1 | R8.2 14.91,28.92 R9.1
N$8
  Top 0.406: 10.48,28.59 R10.1 | R9.2 13.34,28.89 13.02,29.21 12.38,29.84 10.79,29.84 10.48,29.53 10.48,28.91 R10.1 | 9.53,28.89 9.53,28.57 8.26,27.3 8.26,26.67 8.26,21.27 8.57,20.95 T14.2 | 9.53,28.89 9.53,29.21 9.21,29.53 7.62,29.53 7.29,29.86 C3.1 | R10.1 9.53,28.89
N$9
  Top 0.406: R12.2 13.64,24.43 | 13.64,24.43 C7.1 13.64,24.43 | 13.64,24.43 13.64,23.8 13.02,23.18 12.7,22.86 12.7,22.23 12.38,21.91 12.08,21.61 T14.6
N$10
  Top 0.406: 8.89,25.72 8.89,26.99 9.21,27.3 C6.1 | R11.1 8.89,25.72 | 8.89,25.72 8.89,22.23 9.51,21.61 T14.1
N$11
  Top 0.406: 13.64,20 C8.1 | 13.64,20 R15.2 13.02,20.64 12.69,20.3 T14.4 | 13.63,20 13.64,20
N$12
  Top 0.406: R14.1 11.76,23.19 11.43,22.86 11.11,22.86 10.79,22.86 10.48,22.54 10.48,21.27 10.79,20.95 T14.5 12.38,20.95 12.7,21.27 13.02,21.59 13.65,22.23 R13.2 13.64,22.84 13.97,23.18 14.61,23.18 14.92,23.5 14.92,24.13 C7.2
N$13
  Top 0.406: C9.1 9.49,18.4 R16.1 | 9.33,18.6 R16.1 | T14.3 9.68,18.58 R16.1
N$14
  Top 0.406: D1.K 5.08,32.07 C4.2 7.29,33.01 7.3,33.02 7.94,33.02 8.59,33.67 R2.1
N$15
  Top 0.406: 7.62,22.54 7.62,24.45 7.62,24.77 7.3,25.08 6.99,25.08 | T15.2 7.62,22.54 | 6.99,25.08 R17.1 | R18.2 6.99,25.08 | 7.62,22.54 7.62,20.95 7.94,20.64 C9.2
N$16
  Top 0.406: R21.2 4.76,26.97 | 4.76,26.97 C11.1 | 4.76,25.07 R17.2 | R17.2 4.75,26.96 4.76,26.97 | 4.76,25.07 R17.2 | 4.76,25.07 4.76,23.81 | 4.76,23.81 4.76,23.36 T15.4 | R20.1 4.75,23.83 4.76,23.81
N$17
  Top 0.406: R20.2 2.24,22.53 1.91,22.86 1.91,25.4 2.22,25.72 C10.1 | 2.87,22.54 R20.2 | 2.87,22.54 2.87,20.67 R19.1 | T15.5 2.87,22.54 | 2.87,22.54 R20.2
N$18
  Top 0.406: R19.2 2.87,19.37 3.49,19.37 3.81,19.68 3.81,21.27 3.81,21.59 4.13,21.91 | 4.13,21.91 4.14,21.89 T15.6 4.58,21.91 4.13,21.91
N$19
  Top 0.406: R23.1 R22.1 4.75,20.62 5.4,21.27 5.4,22.86 5.73,23.19 T15.3
N$20  (via drill 0.4)
  Top 0.305: R23.2 6.05,17.13 6.35,16.83 v12.7,16.83
  Bottom 0.305: IC2.9 15.05,14.89 12.89,14.89 12.7,15.08 v12.7,16.83 12.7,18.26 12.86,18.41 14.13,18.41 14.45,18.73 14.45,21.11 14.62,21.29 R102.2
N$21
  Bottom 0.305: R25.2 R24.1 20,12.71 20,14.92 | R25.2 C12.2 | IC2.10 17.16,15.54 17.46,15.24 17.46,14.29 | 17.46,14.29 17.46,12.71 R25.2 | IC2.8 17.42,14.24 17.46,14.29 | IC2.4 20.32,16.19 20,15.88 20,14.92 | IC2.6 20.03,14.89 20,14.92
N$22
  Top 0.406: C14.2 R28.1 R29.2
N$23
  Bottom 0.61: JP1.2 37.31,41.09 D6.A
N$24
  Top 0.406: R30.2 R34.2 C15.2 3.17,11.45 | 3.17,11.45 R31.2 | R28.2 4.11,8.27 3.17,9.21 3.17,11.45 | 4.14,11.43 R31.2 | T16.4 R31.2
N$25
  Top 0.406: 4.14,10.16 R31.1 T16.6 T16.5
N$26  (via drill 0.4 pad 0.25)
  Top 0.406: R30.1 4.43,14.62 4.76,14.29 4.76,13.65 5.09,13.32 R32.2 6.99,12.05 6.99,11.11 6.99,10.79 | v6.99,9.37 6.99,10.79 | T16.2 6.99,10.79 | D2.A 5.13,4.82 v5.4,5.08
  Bottom 0.406: v5.4,5.08 6.99,6.67 v6.99,9.37
N$27
  Top 0.406: C16.2 8.26,8.27 C17.1 7.79,8.44 T16.1 8.4,10.14 8.73,10.48 8.73,11.11 8.4,11.45 T16.3 7.79,12.1 7.3,12.58 R33.2
N$28
  Bottom 0.406: JP2.1 23.7,41.8 23.81,41.91 26.51,41.91 26.83,41.59 26.99,41.59
  Bottom 0.61: 26.99,41.59 30,41.59 31.41,41.59 D5.A
N$29
  Top 0.305: R35.2 10.61,14.43 R36.1
  Top 0.406: R36.1 10.79,15.24 11.11,15.56 12.38,15.56 | 12.38,15.56 13.97,15.56 | 13.97,15.56 15.56,15.56 17.46,15.56 | C18.1 12.38,15.56 | R39.1 13.97,15.56 | 17.46,15.56 18.1,15.56 18.73,15.56 19.05,15.24 R42.1 | R40.1 17.46,15.56
N$30
  Top 0.406: R36.2 9.84,12.37 9.84,10.48 10.18,10.14 R37.1 10.79,9.21 | 10.79,9.21 11.11,9.21 12.38,7.94 18.41,7.94 18.73,8.26 T17.2 | 10.79,9.21 10.48,9.21 10.16,8.89 10.16,7.3 9.84,6.99 9.22,6.99 C16.1
N$31
  Top 0.406: R39.2 C20.1 16.5,12.38 17.46,12.38 17.78,12.06 18.08,11.76 T17.6
N$32
  Top 0.406: 13.97,8.57 17.14,8.57 17.78,8.57 18.08,8.88 T17.1 | 13.97,8.57 12.7,8.57 12.38,8.89 C19.1 | R38.1 13.97,8.57
N$33
  Top 0.406: R40.2 16.84,13.32 | 16.84,13.32 16.51,13.65 16.51,14.29 16.18,14.62 C20.2 | R41.1 16.5,11.45 16.83,11.11 16.83,10.79 17.14,10.48 17.46,10.16 18.41,10.16 18.73,10.48 18.73,10.79 T17.5 18.73,12.06 17.48,13.32 16.84,13.32
N$34
  Top 0.406: 19.68,13.32 R42.2 19.05,12.7 19.38,12.37 T17.4 | 19.68,13.32 C21.1 | 19.68,13.32
N$35
  Top 0.406: 21.14,9.06 R43.1 | C22.1 21.29,9.18 R43.1 | R43.1 19.55,9.19 T17.3
N$36
  Top 0.406: R29.1 6.33,8.27 6.67,7.94 6.67,7.3 7,6.97 C17.2 7.62,4.76 D2.K
N$37
  Top 0.406: C22.2 19.05,7.62 18.73,7.3 17.14,7.3 | 17.14,7.3 16.83,7.3 15.24,7.3 14.92,7.3 14.61,6.99 14.61,6.67 | T18.2 17.14,7.3 | 14.61,6.67 R44.1 | R45.2 14.61,6.67
N$38
  Top 0.406: R48.2 12.71,4.45 | 12.71,4.45 C24.1 | 12.71,4.45 12.73,4.43 R44.2 14.62,4.45 15.88,4.45 | 15.88,4.45 16.33,4.45 T18.4 | R47.1 15.86,4.43 15.88,4.45
N$39
  Top 0.406: T18.5 17.14,2.56 | 17.14,2.56 R47.2 | 17.14,2.56 19.02,2.56 R46.1 | 17.14,2.56 17.14,1.91 16.83,1.59 14.29,1.59 13.97,1.91 C23.1
N$40
  Top 0.406: R46.2 20.34,3.16 20,3.49 18.73,3.49 18.3,3.93 17.95,4.28 T18.6
N$41
  Top 0.406: R50.1 R49.1 19.07,4.43 18.41,5.08 17.46,5.08 16.83,5.08 16.5,5.41 T18.3
N$43
  Top 0.406: C25.2 R51.1 R52.2
N$44
  Top 0.406: R53.2 R57.2 C26.2 28.24,3.17 | R54.2 28.24,3.17 | R51.2 31.42,4.11 30.48,3.17 28.24,3.17 | 28.26,4.14 R54.2 | T19.4 R54.2
N$45
  Top 0.406: 29.53,4.14 R54.1 T19.6 T19.5
N$46  (via drill 0.4 pad 0.25)
  Top 0.406: R53.1 25.07,4.43 25.4,4.76 26.04,4.76 26.37,5.09 R55.2 26.37,5.73 27.62,6.99 28.57,6.99 28.89,6.99 | v30.32,6.99 28.89,6.99 | T19.2 28.89,6.99 | D3.A 35.13,4.87 v34.61,5.4
  Bottom 0.406: v34.61,5.4 33.02,6.99 v30.32,6.99
N$47
  Top 0.406: R56.2 27.11,7.3 27.59,7.79 T19.3 28.24,8.4 28.57,8.73 29.21,8.73 29.54,8.4 T19.1 31.25,7.79 C28.1 31.42,8.26 | 31.42,8.26 C27.2 | 31.3,8.13 31.42,8.26
N$48
  Bottom 0.305: U$2.41 7.19,28.53 6.99,28.73 4.76,28.73 TP1.TP
N$49
  Top 0.305: R58.2 25.26,10.61 R59.1
  Top 0.406: R59.1 24.45,10.79 24.13,11.11 24.13,12.38 | 24.13,12.38 24.13,13.97 | 24.13,13.97 24.13,17.46 | 24.13,17.46 24.13,18.73 24.45,19.05 R65.1 | C29.1 24.13,12.38 | R62.1 24.13,13.97 | R63.1 24.13,17.46
N$50
  Top 0.406: R59.2 27.32,9.84 29.21,9.84 29.54,10.18 R60.1 30.48,10.79 | T20.2 31.43,18.73 31.75,18.41 31.75,12.38 30.48,11.11 30.48,10.79 | 30.48,10.79 30.48,10.48 30.8,10.16 32.38,10.16 32.7,9.84 32.7,9.22 C27.1
N$51
  Top 0.406: R62.2 C31.1 27.3,16.5 27.3,17.46 27.62,17.78 27.93,18.08 T20.6
N$52
  Top 0.406: 31.11,13.97 31.11,17.46 31.11,17.78 30.8,18.1 30.34,18.1 T20.1 | 31.11,13.97 31.11,12.7 30.8,12.38 C30.1 | R61.1 31.11,13.97
N$53
  Top 0.406: C31.2 25.07,16.18 25.4,16.51 26.04,16.51 26.37,16.84 R63.2 27.64,18.73 T20.5 28.89,18.73 29.21,18.73 29.53,18.41 29.53,17.46 28.89,16.83 28.57,16.83 28.26,16.51 28.26,15.89 R64.1
N$54
  Top 0.406: 26.37,19.68 R65.2 26.99,19.05 27.32,19.38 T20.4 | 26.37,19.68 C32.1 | 26.37,19.68
N$55
  Top 0.406: C33.1 30.51,21.29 R66.1 30.5,19.55 T20.3
N$56
  Top 0.406: R52.1 31.42,6.33 31.75,6.67 32.38,6.67 32.72,7 C28.2 34.92,7.62 D3.K
N$57
  Top 0.406: C33.2 32.07,19.05 32.38,18.73 32.38,17.14 | 32.38,17.14 32.38,16.19 32.38,14.92 32.7,14.61 33.02,14.61 | T21.2 32.38,17.14 | 33.02,14.61 R67.1 | R68.2 33.02,14.61
N$58
  Top 0.406: R71.2 35.24,12.71 | 35.24,12.71 C35.1 | 35.24,12.71 35.26,12.73 R67.2 35.24,14.62 35.24,15.88 | 35.24,15.88 35.24,16.33 T21.4 | R70.1 35.26,15.86 35.24,15.88
N$59
  Top 0.406: R70.2 R69.1 | R70.2 37.77,17.16 38.1,16.83 38.1,14.29 37.78,13.97 C34.1 | T21.5 37.13,17.14 R70.2
N$60
  Top 0.406: R69.2 36.53,20.34 36.2,20 36.2,18.41 35.58,17.8 T21.6
N$61
  Top 0.406: R73.1 R72.1 35.26,19.07 34.61,18.41 34.61,16.83 34.27,16.5 T21.3
N$62
  Bottom 0.305: JP3.2 11.11,40.64 11.59,40.16 15.24,40.16 15.56,40.16 17.92,40.16 R27.2
N$63
  Top 0.406: C36.2 R74.1 R75.2
N$64
  Top 0.406: R76.2 R80.2 C37.2 36.83,27.93 | R77.2 36.83,27.93 | R74.2 35.89,31.1 36.83,30.16 36.83,27.93 | 35.86,27.94 R77.2 | T22.4 R77.2
N$65
  Top 0.406: 35.86,29.21 R77.1 T22.6 T22.5
N$66  (via drill 0.4 pad 0.25)
  Top 0.406: R76.1 35.58,24.75 35.24,25.08 35.24,25.72 34.91,26.05 R78.2 34.27,26.05 33.02,27.3 33.02,28.26 33.02,28.57 | v33.02,30 33.02,28.57 | T22.2 33.02,28.57 | D4.A 35.93,34.82 v34.92,33.81
  Bottom 0.406: v33.02,30 33.02,31.91 v34.92,33.81
N$67
  Top 0.406: C38.2 31.75,31.1 | 31.75,31.1 C39.1 32.22,30.93 T22.1 31.61,29.23 31.27,28.89 31.27,28.26 31.61,27.93 T22.3 32.22,27.27 32.7,26.79 R79.2 | 31.87,30.98 31.75,31.1
N$68
  Bottom 0.305: JP3.1 8.57,40.64 8.57,40.01 9.05,39.53 12.22,39.53 13.65,39.53 16.21,39.53 R104.2
N$69
  Top 0.305: R81.2 29.4,24.94 R82.1
  Top 0.406: R82.1 29.21,24.13 28.89,23.81 27.62,23.81 | 27.62,23.81 26.04,23.81 | 26.04,23.81 22.54,23.81 | 22.54,23.81 21.27,23.81 20.95,24.13 R88.1 | C40.1 27.62,23.81 | R85.1 26.04,23.81 | R86.1 22.54,23.81
N$70
  Top 0.406: R82.2 30.16,27 30.16,28.89 29.83,29.23 R83.1 29.21,30.16 | T23.2 21.27,31.11 21.59,31.43 27.62,31.43 28.89,30.16 29.21,30.16 | 29.21,30.16 29.53,30.16 29.84,30.48 29.84,32.07 30.16,32.38 30.78,32.38 C38.1
N$71
  Top 0.406: R85.2 C42.1 23.51,26.99 22.54,26.99 22.22,27.31 21.92,27.61 T23.6
N$72
  Top 0.406: 26.04,30.8 22.54,30.8 22.23,30.8 21.91,30.48 21.91,30.02 T23.1 | 26.04,30.8 27.3,30.8 27.62,30.48 C41.1 | R84.1 26.04,30.8
N$73
  Top 0.406: C42.2 23.83,24.75 23.5,25.08 23.5,25.72 23.16,26.05 R86.2 21.27,27.32 T23.5 21.27,28.57 21.27,28.89 21.59,29.21 22.54,29.21 23.18,28.57 23.18,28.26 23.5,27.94 24.11,27.94 R87.1
N$74
  Top 0.406: 20.32,26.05 R88.2 20.95,26.67 20.62,27 T23.4 | 20.32,26.05 C43.1 | 20.32,26.05
N$75
  Top 0.406: C44.1 18.72,30.19 R89.1 18.91,30.36 20.27,30.36 T23.3
N$76
  Top 0.406: R75.1 33.67,31.1 33.34,31.43 33.34,32.07 33.01,32.4 C39.2 32.38,34.61 D4.K
N$77
  Top 0.406: C44.2 20.95,31.75 21.27,32.07 22.86,32.07 | 22.86,32.07 24.45,32.07 25.08,32.07 25.4,32.38 25.4,32.7 | T24.2 22.86,32.07 | 25.4,32.7 R90.1 | R91.2 25.4,32.7
N$78
  Top 0.406: 25.39,34.92 R90.2 | C46.1 27.29,34.92 | 27.29,34.92 R94.2 | R90.2 27.27,34.94 27.29,34.92 | 25.39,34.92 R90.2 | 25.39,34.92 24.13,34.92 | 24.13,34.92 23.68,34.92 T24.4 | R93.1 24.14,34.94 24.13,34.92
N$79
  Top 0.406: R92.1 R93.2 22.86,36.81 | T24.5 22.86,36.81 | 22.86,36.81 22.86,37.47 23.18,37.78 25.72,37.78 26.04,37.47 C45.1
N$80
  Top 0.406: R92.2 19.68,36.81 19.68,36.2 20,35.88 21.59,35.88 22.21,35.26 T24.6
N$81
  Top 0.406: R96.1 R95.1 20.94,34.94 21.59,34.29 23.18,34.29 23.51,33.96 T24.3
N$82
  Bottom 0.406: JP2.3 25,38.82 25.08,38.73 U$1.13
N$83
  Bottom 0.406: JP2.2 24.35,38.95 23.81,38.42 U$1.12
N$84  (via drill 0.4)
  Top 0.305: R50.2 22.24,5.73 22.86,6.35 v22.86,13.93
  Bottom 0.305: R101.2 26.04,14.61 25.67,14.24 25.36,13.93 v22.86,13.93 22.54,14.24 IC2.7
N$85  (via drill 0.4)
  Top 0.305: R96.2 17.77,33.64 17.46,33.34 17.3,33.18 17.3,28.26 17.3,27.78 17.3,27.15 17.3,26.67 17.3,24.13 17.94,23.5 17.94,23.34 17.94,22.23 17.62,21.91 17.62,20 17.62,19.05 17.62,18.41 19.05,17.14 v19.05,16.83
  Bottom 0.305: v19.05,16.83 18.41,16.19 17.78,16.19 IC2.11 14.14,16.19 R103.2
N$87  (via drill 0.4)
  Top 0.305: R73.2 33.96,21.61 33.02,22.54 29.84,22.54 29.69,22.7 28.42,22.7 27.62,21.91 23.97,21.91 23.34,21.27 23.18,21.11 23.18,18.57 22.86,18.26 v22.86,15.54
  Bottom 0.305: IC2.5 v22.86,15.54 24.13,15.54 R26.2
SENSOR1  (via drill 0.4 pad 0.25)
  Top 0.305: v18.89,19.05 18.89,22.54 v19.21,22.86
  Bottom 0.305: R100.1 v18.89,19.05 16.86,17.49 IC2.13 14.14,17.49 R103.1 | U$2.10 11.12,21.59 10.79,21.91 10.79,23.18 10.79,25.24 11.14,25.59 U$2.2 13.47,25.59 14.76,24.29 19.05,24.29 19.21,24.13 v19.21,22.86
SENSOR2  (via drill 0.4 pad 0.25)
  Top 0.305: v17.14,22.86 16.83,22.53 16.83,20.3 v16.83,19.05
  Bottom 0.305: v16.83,19.05 R99.1 16.81,20 | v16.83,19.05 16.83,18.52 16.45,18.14 IC2.14 15.51,18.14 15.4,18.26 R102.1 | 16.81,19.07 v16.83,19.05 | U$2.4 13.18,24.59 | U$2.3 13.17,25.09 13.18,25.08 13.18,24.59 | 13.18,24.59 13.2,24.59 13.65,24.13 14.13,23.65 16.83,23.65 17.14,23.34 v17.14,22.86
SENSOR3  (via drill 0.4)
  Top 0.305: v21.91,19.05 21.91,22.23 v22.07,22.54
  Bottom 0.305: IC2.1 23.18,18.14 | 23.18,18.14 25.67,18.14 26.04,17.78 R101.1 | R98.1 23.18,19.05 | 23.18,19.05 23.18,18.14 | 10.69,27.57 U$2.48 10.69,27.57 | 10.69,27.57 10.69,26.56 10.48,26.35 9.84,26.35 9.21,25.72 6.58,23.09 U$2.30 | 23.18,19.05 v21.91,19.05 | v22.07,22.54 22.07,25.08 21.59,25.56 15.4,25.56 14.29,26.67 11.91,26.67 11.01,27.57 10.69,27.57
SENSOR4  (via drill 0.4 pad 0.25)
  Top 0.305: v20.48,19.05 20.48,22.54 v20.64,22.7
  Bottom 0.305: 21.56,17.49 IC2.2 24.11,17.49 R26.1 | R97.1 v20.48,19.05 20.48,18.73 20.48,18.41 20.48,17.78 20.77,17.49 21.56,17.49 | 21.56,17.49 20.93,17.49 | U$2.20 7.19,22.43 9.76,25 10.93,26.09 U$2.1 13.92,26.09 15.08,24.92 20.16,24.92 20.64,24.45 v20.64,22.7
USB_SERIAL_IN
  Bottom 0.305: U$2.45 9.19,29.35 9.53,29.69 11.11,29.69 16.51,29.69 20,29.69 | 20,29.69 U$1.6 | 20,29.69 21.59,29.69 21.91,30 21.91,32.7 21.91,33.02 21.27,33.66 18.26,33.66 17.94,33.97 R27.1
USB_SERIAL_OUT
  Bottom 0.305: U$2.44 8.69,29.8 9.21,30.32 15.56,30.32 17.62,30.32 17.94,30.64 17.94,32.54 17.94,33.02 | 17.94,33.02 17.3,33.66 17.3,37.13 R104.1 | 17.94,33.02 20.8,33.02 21.27,32.54 U$1.5

### Text on the board
tNames: GND | RX | TX | GND | +5V
bNames: UPDI | OSHW | VIVE Position / Sensor v1.1 | http://hacks.esar.org.uk/ | (c) 2018